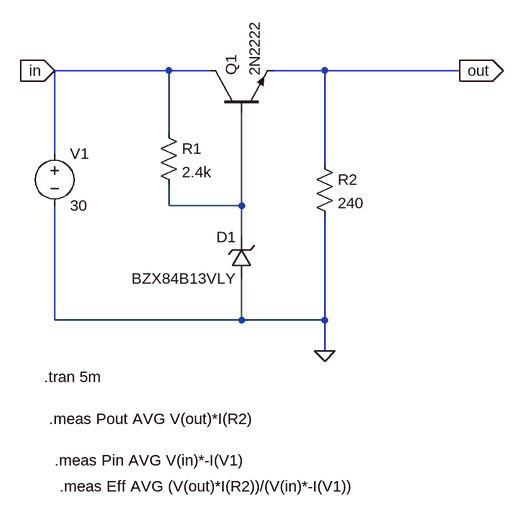
[diagram p0: schematic Bai 1.asc]
Bai 1.asc, the LTspice schematic file:
Version 4
SHEET 1 1432 680
WIRE 208 -224 32 -224
WIRE 272 -224 208 -224
WIRE 448 -224 368 -224
WIRE 656 -224 448 -224
WIRE 208 -128 208 -224
WIRE 32 -96 32 -224
WIRE 448 -80 448 -224
WIRE 208 -16 208 -48
WIRE 320 -16 320 -160
WIRE 320 -16 208 -16
WIRE 320 32 320 -16
WIRE 32 160 32 -16
WIRE 320 160 320 96
WIRE 320 160 32 160
WIRE 448 160 448 0
WIRE 448 160 320 160
WIRE 448 208 448 160
FLAG 32 -224 in
IOPIN 32 -224 In
FLAG 448 208 0
FLAG 656 -224 out
IOPIN 656 -224 Out
SYMBOL voltage 32 -112 R0
WINDOW 123 0 0 Left 0
WINDOW 39 0 0 Left 0
SYMATTR InstName V1
SYMATTR Value 30
SYMBOL npn 272 -160 R270
SYMATTR InstName Q1
SYMATTR Value 2N2222
SYMBOL res 192 -144 R0
SYMATTR InstName R1
SYMATTR Value 2.4k
SYMBOL zener 336 96 R180
WINDOW 0 24 64 Left 2
WINDOW 3 24 0 Left 2
SYMATTR InstName D1
SYMATTR Value BZX84B13VLY
SYMBOL res 432 -96 R0
SYMATTR InstName R2
SYMATTR Value 240
TEXT 16 248 Left 2 !.tran 5m
TEXT 24 312 Left 2 !.meas Pout AVG V(out)*I(R2)
TEXT 32 376 Left 2 !.meas Pin AVG V(in)*-I(V1)
TEXT 40 416 Left 2 !.meas Eff AVG (V(out)*I(R2))/(V(in)*-I(V1))

The netlist it stands for:
* Bai 1.asc
V1 in 0 30
Q1 in N001 out 0 2N2222
R1 in N001 2.4k
D1 0 N001 BZX84B13VLY
R2 out 0 240
.model D D
.lib standard.dio
.model NPN NPN
.model PNP PNP
.lib standard.bjt
.tran 5m
.meas Pout AVG V(out)*I(R2)
.meas Pin AVG V(in)*-I(V1)
.meas Eff AVG (V(out)*I(R2))/(V(in)*-I(V1))
.backanno
.end